# EAGLE schematic pj7 (EAGLE 7.3.2)
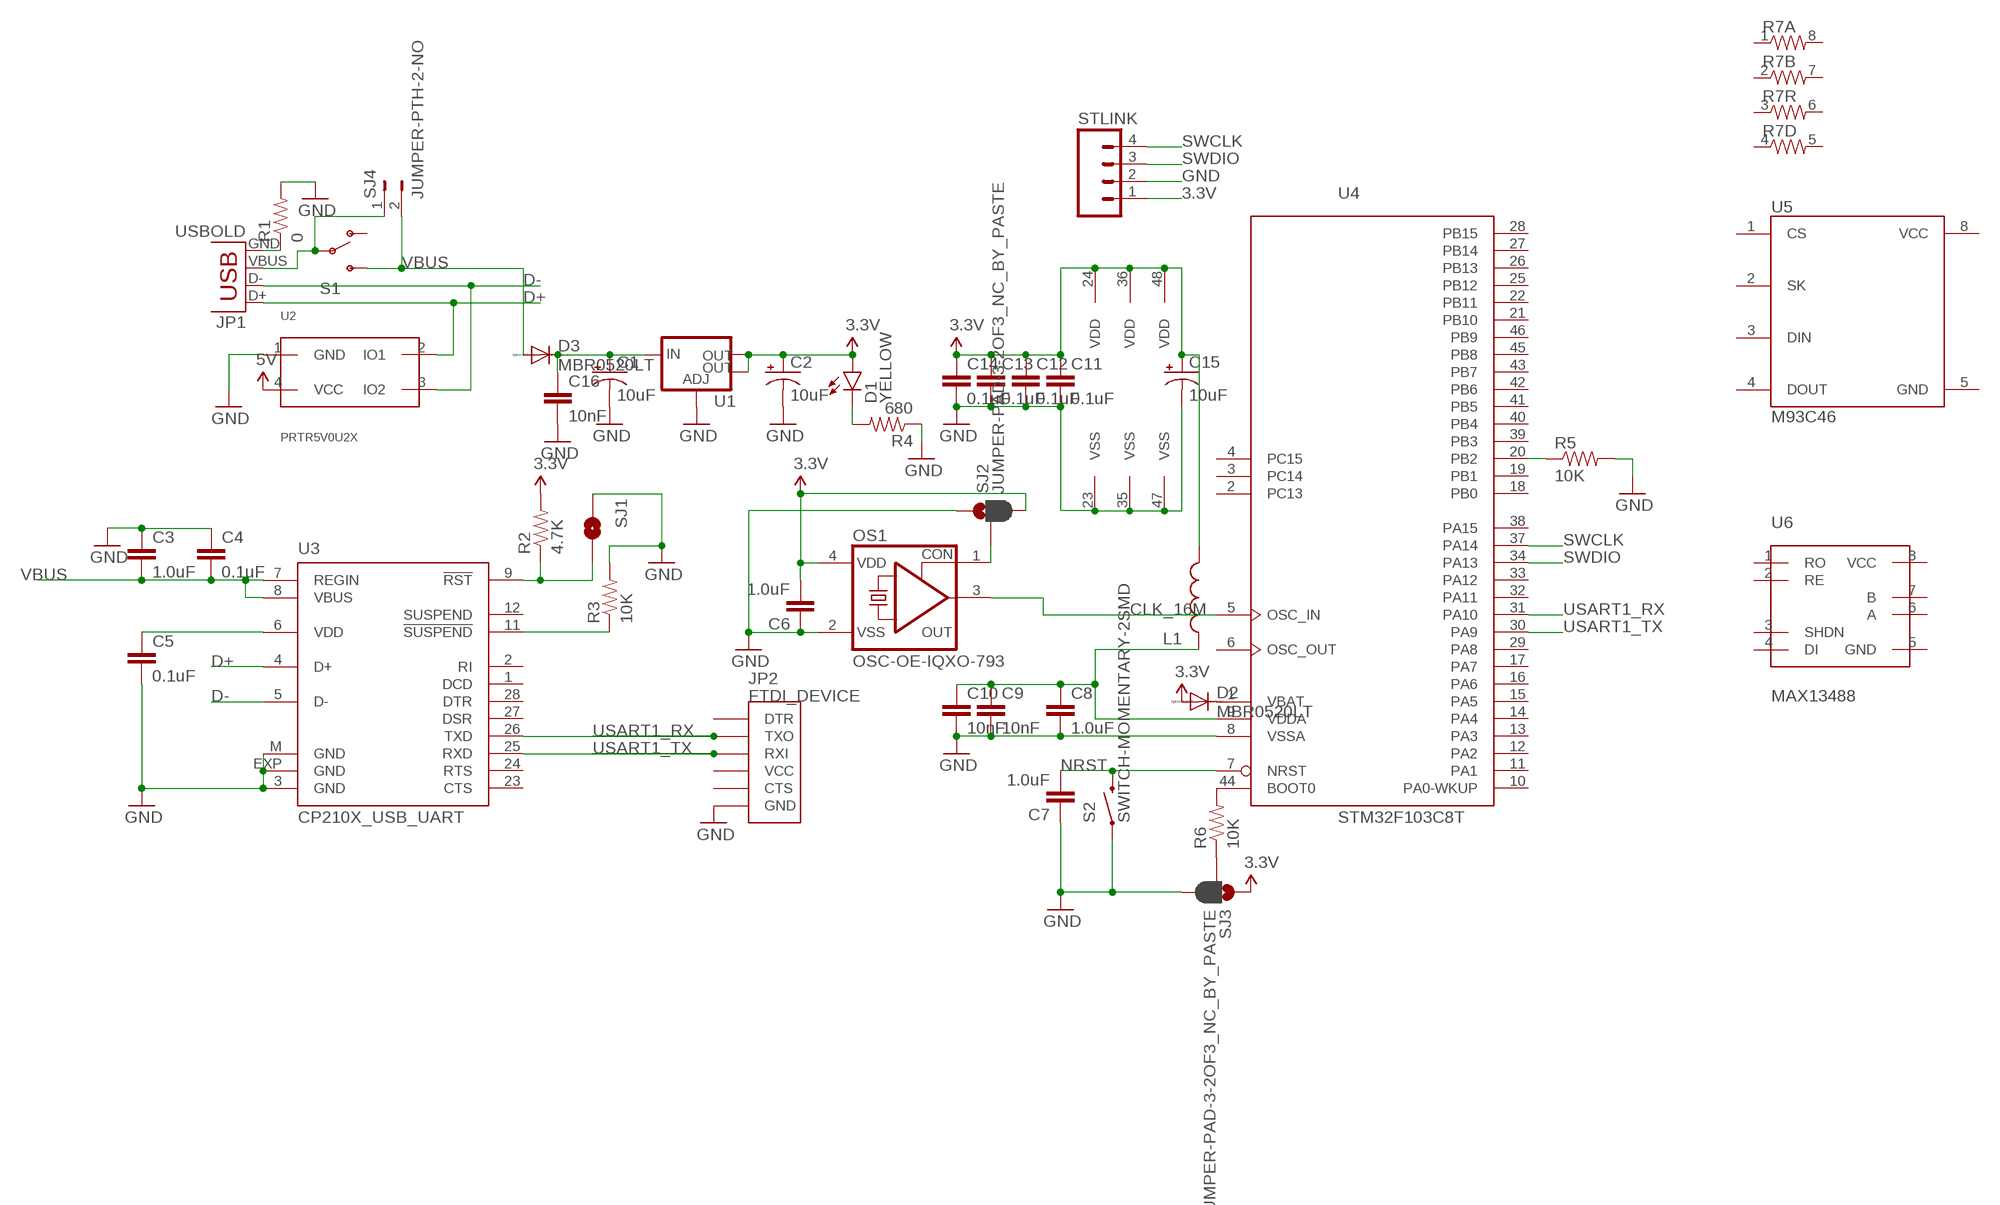
[diagram p0: schematic, sheet 1]

## Parts
C1  10uF  10UF-16V-10%(TANT)  [EIA3216]
C2  10uF  10UF-16V-10%(TANT)  [EIA3216]
C3  1.0uF  1.0UF-16V-10%(0603)  [0603-CAP]
C4  0.1uF  0.1UF-25V-5%(0603)  [0603-CAP]
C5  0.1uF  0.1UF-25V-5%(0603)  [0603-CAP]
C6  1.0uF  1.0UF-16V-10%(0603)  [0603-CAP]
C7  1.0uF  1.0UF-16V-10%(0603)  [0603-CAP]
C8  1.0uF  1.0UF-16V-10%(0603)  [0603-CAP]
C9  10nF  10NF/10000PF-50V-10%(0603)  [0603-CAP]
C10  10nF  10NF/10000PF-50V-10%(0603)  [0603-CAP]
C11  0.1uF  0.1UF-25V-5%(0603)  [0603-CAP]
C12  0.1uF  0.1UF-25V-5%(0603)  [0603-CAP]
C13  0.1uF  0.1UF-25V-5%(0603)  [0603-CAP]
C14  0.1uF  0.1UF-25V-5%(0603)  [0603-CAP]
C15  10uF  10UF-16V-10%(TANT)  [EIA3216]
C16  10nF  10NF/10000PF-50V-10%(0603)  [0603-CAP]
D1  YELLOW  LED-YELLOW1206  [LED-1206]
D2  MBR0520LT  [SOD123]
D3  MBR0520LT  [SOD123]
JP1  USBOLD  [USB-MINIB-OLD]
JP2  FTDI_DEVICE  [FTDI_DEVICE_SIDE]
L1  INDUCTOR0603  [0603]
OS1  OSC-OE-IQXO-793  [2.5X2-4-PAD]
R1  0  0OHM-1/10W-5%(0603)  [0603]
R2  4.7K  4.7KOHM-1/10W-1%(0603)  [0603-RES]
R3  10K  4.7KOHM-1/10W-1%(0603)  [0603-RES]
R4  680  680OHM1/10W5%(0603)  [0603-RES]
R5  10K  10KOHM-1/10W-1%(0603)0603  [0603-RES]
R6  10K  10KOHM-1/10W-1%(0603)0603  [0603-RES]
R7  RESISTOR-ARRAY0603-ARV  [0603-ARV]
S1  SWITCH-SPDTSMD  [AYZ0202]
S2  SWITCH-MOMENTARY-2SMD  [TACTILE-SWITCH-SMD]
SJ1  JUMPER-PAD-2-NOYES_SILK  [PAD-JUMPER-2-NO_YES_SILK]
SJ2  JUMPER-PAD-3-2OF3_NC_BY_PASTE  [PAD-JUMPER-3-2OF3_NC_BY_PASTE_YES_SILK_FULL_BOX]
SJ3  JUMPER-PAD-3-2OF3_NC_BY_PASTE  [PAD-JUMPER-3-2OF3_NC_BY_PASTE_YES_SILK_FULL_BOX]
SJ4  JUMPER-PTH-2-NO  [PTH-JUMPER-2-NO_NO_SILK]
STLINK  M04LOCK  [1X04_LOCK]
U1  V_REG_LM1117SOT223  [SOT223]
U2  PRTR5V0U2X  [SOT143]
U3  CP210X_USB_UART  [MLP28]
U4  STM32F103C8T  [LQFP48]
U5  M93C46  [SO08]
U6  MAX13488  [SOIC8]

## Nets
3.3V: C2.A(+) C6.2 C11.1 C12.1 C13.1 C14.1 C15.A(+) D1.A D2.A L1.2 OS1.4(VDD) R2.2 SJ2.3 SJ3.1 STLINK.1 U1.2(OUT) U1.4(OUT) U4.24(VDD) U4.36(VDD) U4.48(VDD)
5V: U2.4(VCC)
CLK_16M: OS1.3(OUT) U4.5(OSC_IN)
D+: JP1.D+ U2.2(IO1) U3.4(D+)
D-: JP1.D- U2.3(IO2) U3.5(D-)
GND: C1.C(-) C2.C(-) C3.1 C4.1 C5.2 C6.1 C7.1 C8.2 C9.2 C10.2 C11.2 C12.2 C13.2 C14.2 C15.C(-) C16.2 JP2.P$6(GND) OS1.2(VSS) R1.2 R3.2 R4.1 R5.2 S2.1 SJ1.2 SJ2.1 SJ3.3 STLINK.2 U1.1(ADJ) U2.1(GND) U3.3(GND) U3.EXP(GND) U3.M(GND) U4.8(VSSA) U4.23(VSS) U4.35(VSS) U4.47(VSS)
N$1: JP1.GND R1.1
N$2: R3.1 U3.11(!SUSPEND)
N$3: D1.C R4.2
N$4: D2.C U4.1(VBAT)
N$5: JP1.VBUS S1.2(P) SJ4.1
N$6: C8.1 C9.1 C10.1 L1.1 U4.9(VDDA)
N$7: R6.2 U4.44(BOOT0)
N$8: R5.1 U4.20(PB2)
N$9: R6.1 SJ3.2
N$10: R2.1 SJ1.1 U3.9(!RST)
N$11: OS1.1(CON) SJ2.2
N$12: C1.A(+) C16.1 D3.C U1.3(IN)
N$15: C5.1 U3.6(VDD)
NRST: C7.2 S2.3 U4.7(NRST)
SWCLK: STLINK.4 U4.37(PA14)
SWDIO: STLINK.3 U4.34(PA13)
USART1_RX: JP2.P$2(TXO) U3.26(TXD) U4.31(PA10)
USART1_TX: JP2.P$3(RXI) U3.25(RXD) U4.30(PA9)
VBUS: C3.2 C4.2 D3.A S1.3(S) SJ4.2 U3.7(REGIN) U3.8(VBUS)
Unconnected: JP2.P$1(DTR) JP2.P$4(VCC) JP2.P$5(CTS) R7.1 R7.2 R7.3 R7.4 R7.5 R7.6 R7.7 R7.8 S1.1(O) U3.1(DCD) U3.2(RI) U3.12(SUSPEND) U3.23(CTS) U3.24(RTS) U3.27(DSR) U3.28(DTR) U4.2(PC13) U4.3(PC14) U4.4(PC15) U4.6(OSC_OUT) U4.10(PA0-WKUP) U4.11(PA1) U4.12(PA2) U4.13(PA3) U4.14(PA4) U4.15(PA5) U4.16(PA6) U4.17(PA7) U4.18(PB0) U4.19(PB1) U4.21(PB10) U4.22(PB11) U4.25(PB12) U4.26(PB13) U4.27(PB14) U4.28(PB15) U4.29(PA8) U4.32(PA11) U4.33(PA12) U4.38(PA15) U4.39(PB3) U4.40(PB4) U4.41(PB5) U4.42(PB6) U4.43(PB7) U4.45(PB8) U4.46(PB9) U5.1(CS) U5.2(SK) U5.3(DIN) U5.4(DOUT) U5.5(GND) U5.8(VCC) U6.1(RO) U6.2(RE) U6.3(SHDN) U6.4(DI) U6.5(GND) U6.6(A) U6.7(B) U6.8(VCC)

## Library data of the parts
C1 C2 C15 = SparkFun-Capacitors:10UF-16V-10%(TANT): CAP-00811 1206/EIA-3216 Tantalum capacitor; PROD_ID: CAP-00811
C3 C6-C8 = SparkFun-Capacitors:1.0UF-16V-10%(0603): CAP-00868; PROD_ID: CAP-00868
C4 C5 C11-C14 = SparkFun-Capacitors:0.1UF-25V-5%(0603): CAP-08604; PROD_ID: CAP-08604
C9 C10 C16 = SparkFun-Capacitors:10NF/10000PF-50V-10%(0603): CAP-00867; PROD_ID: CAP-00867
D1 = SparkFun-LED:LED-YELLOW: Yellow SMD LEDs LilyPad 1206- DIO-09909 0603- DIO-09003 "SMART" means more efficient and expensive; PROD_ID: DIO-00820
D2 D3 = diode:MBR0520LT: SCHOTTKY BARRIER RECTIFIER Source: http://onsemi.com .. MBR0520LT1-D.pdf
JP1 = SparkFun-Connectors:USB: USB Connectors USB-B-PTH is fully proven SKU : PRT-00139/CONN-08278 USB-miniB is fully proven SKU : PRT-00587 USB-A-PCB is untested. USB-A-H is throughly reviewed, but untested. Spark Fun Electronics SKU : PRT-00437 USB-B-SMT is throughly reviewed, but untested. Needs silkscreen touching up. USB-A-S has not been used/tested USB-MB-H has not been used/tested USB-MICROB has been used. CONN-09505
JP2 = SparkFun-Connectors:FTDI_DEVICE: Connector which mates to FTDI basic or FTDI cable.
L1 = SparkFun-Passives:INDUCTOR: Inductors Basic Inductor/Choke - 0603 and 1206. Footprints are not proven and vary greatly between part numbers. INDUCTOR POWER 3.3UH 4.0A SMD 0.197" L x 0.197" W x 0.177" H (5.00mm x 5.00mm x 4.50mm)
OS1 = IQD-Frequency-Products:OSC-OE: OSCILLATOR WITH OE
R1 = SparkFun-Resistors:0OHM-1/10W-5%(0603): RES-08609; PROD_ID: RES-08609
R2 = SparkFun-Resistors:4.7KOHM-1/10W-1%(0603): RES-07857; PROD_ID: RES-07857
R3 = SparkFun-Resistors:4.7KOHM-1/10W-1%(0603): RES-07857; PROD_ID: RES-07857; VALUE: 4.7K
R4 = SparkFun-Resistors:680OHM1/10W5%(0603): RES-09333; PROD_ID: RES-09333
R5 R6 = SparkFun-Resistors:10KOHM-1/10W-1%(0603): RES-00824; PROD_ID: RES-00824
R7 = SparkFun-Resistors:RESISTOR-ARRAY: Array Chip Resistor Source: RS Component / Phycomp
S1 = SparkFun-Electromechanical:SWITCH-SPDT: SPDT Switch Simple slide switch, Spark Fun Electronics SKU : COM-00102 DPDT SMT slide switch, AYZ0202, SWCH-08179; PROD_ID: SWCH-08179; SF_ID: COM-00597
S2 = SparkFun-Electromechanical:SWITCH-MOMENTARY-2: Various NO switches- pushbuttons, reed, etc; PROD_ID: SWCH-08247
SJ1 = SparkFun-Passives:JUMPER-PAD-2-NO
SJ2 SJ3 = SparkFun-Passives:JUMPER-PAD-3-2OF3_NC_BY_PASTE
SJ4 = SparkFun-Passives:JUMPER-PTH-2-NO
STLINK = SparkFun-Connectors:M04: Header 4 Standard 4-pin 0.1" header. Use with straight break away headers (SKU : PRT-00116), right angle break away headers (PRT-00553), swiss pins (PRT-00743), machine pins (PRT-00117), and female headers (PRT-00115). Molex polarized connector foot print use with SKU : PRT-08231 with associated crimp pins and housings. 1MM SMD Version SKU: PRT-10208
U1 = SparkFun-PowerIC:V_REG_LM1117: Voltage Regulator LM1117 Standard adjustable voltage regulator but in SMD form. Spark Fun Electronics SKU : COM-00595; PROD_ID: VREG-08170
U2 = semicon-smd-ipc:PRTR5V0U2X
U3 = SparkFun-DigitalIC:CP210X_USB_UART: Single-Chip USB to UART Bridge Source: www.silabs.com .. CP2101.pdf / cp2102.pdf. Spark Fun Electronics SKU : COM-00310
U4 = micro-stm_v3:STM32F103C*T: ARM 32-bit Cortex™-M3 CPU 72 MHz maximum frequency 16 to 128 Kbytes of Flash memory 6 to 20 kbytes of SRAM 37 GPIOs 2.0 to 3.6 V application supply
U5 = SparkFun-DigitalIC:M93C46: 1kbit SPI EEPROM
U6 = SparkFun-DigitalIC:MAX13488